# Altium schematic sheet [06] - REVISION HISTORY.SchDoc: REVISION HISTORY
size 433 x 279 mm; Author: ZAG; DrawnBy: ZAG; DocumentNumber: 6; SheetNumber: 6; SheetTotal: 6; PageSetup: Record=PageOptions|CenterHorizontal=True|CenterVertical=True|PrintScale=0.96|XCorrection=1.00|YCorrection=1.00|PrintKind=2|BorderSize=5000000|LeftOffset=0|BottomOffset=0|Orientation=2|PaperLength=4318|PaperWidth=2794|Scale=100|PaperSource=15|PrintQuality=600|MediaType=1|DitherType=10|PaperKind=11x17|PrintScaleMode=1; SchRevision: 01; PCBRevision: 01; Project: VAN BATT CTRLR V1; SchStatus: PRELIM
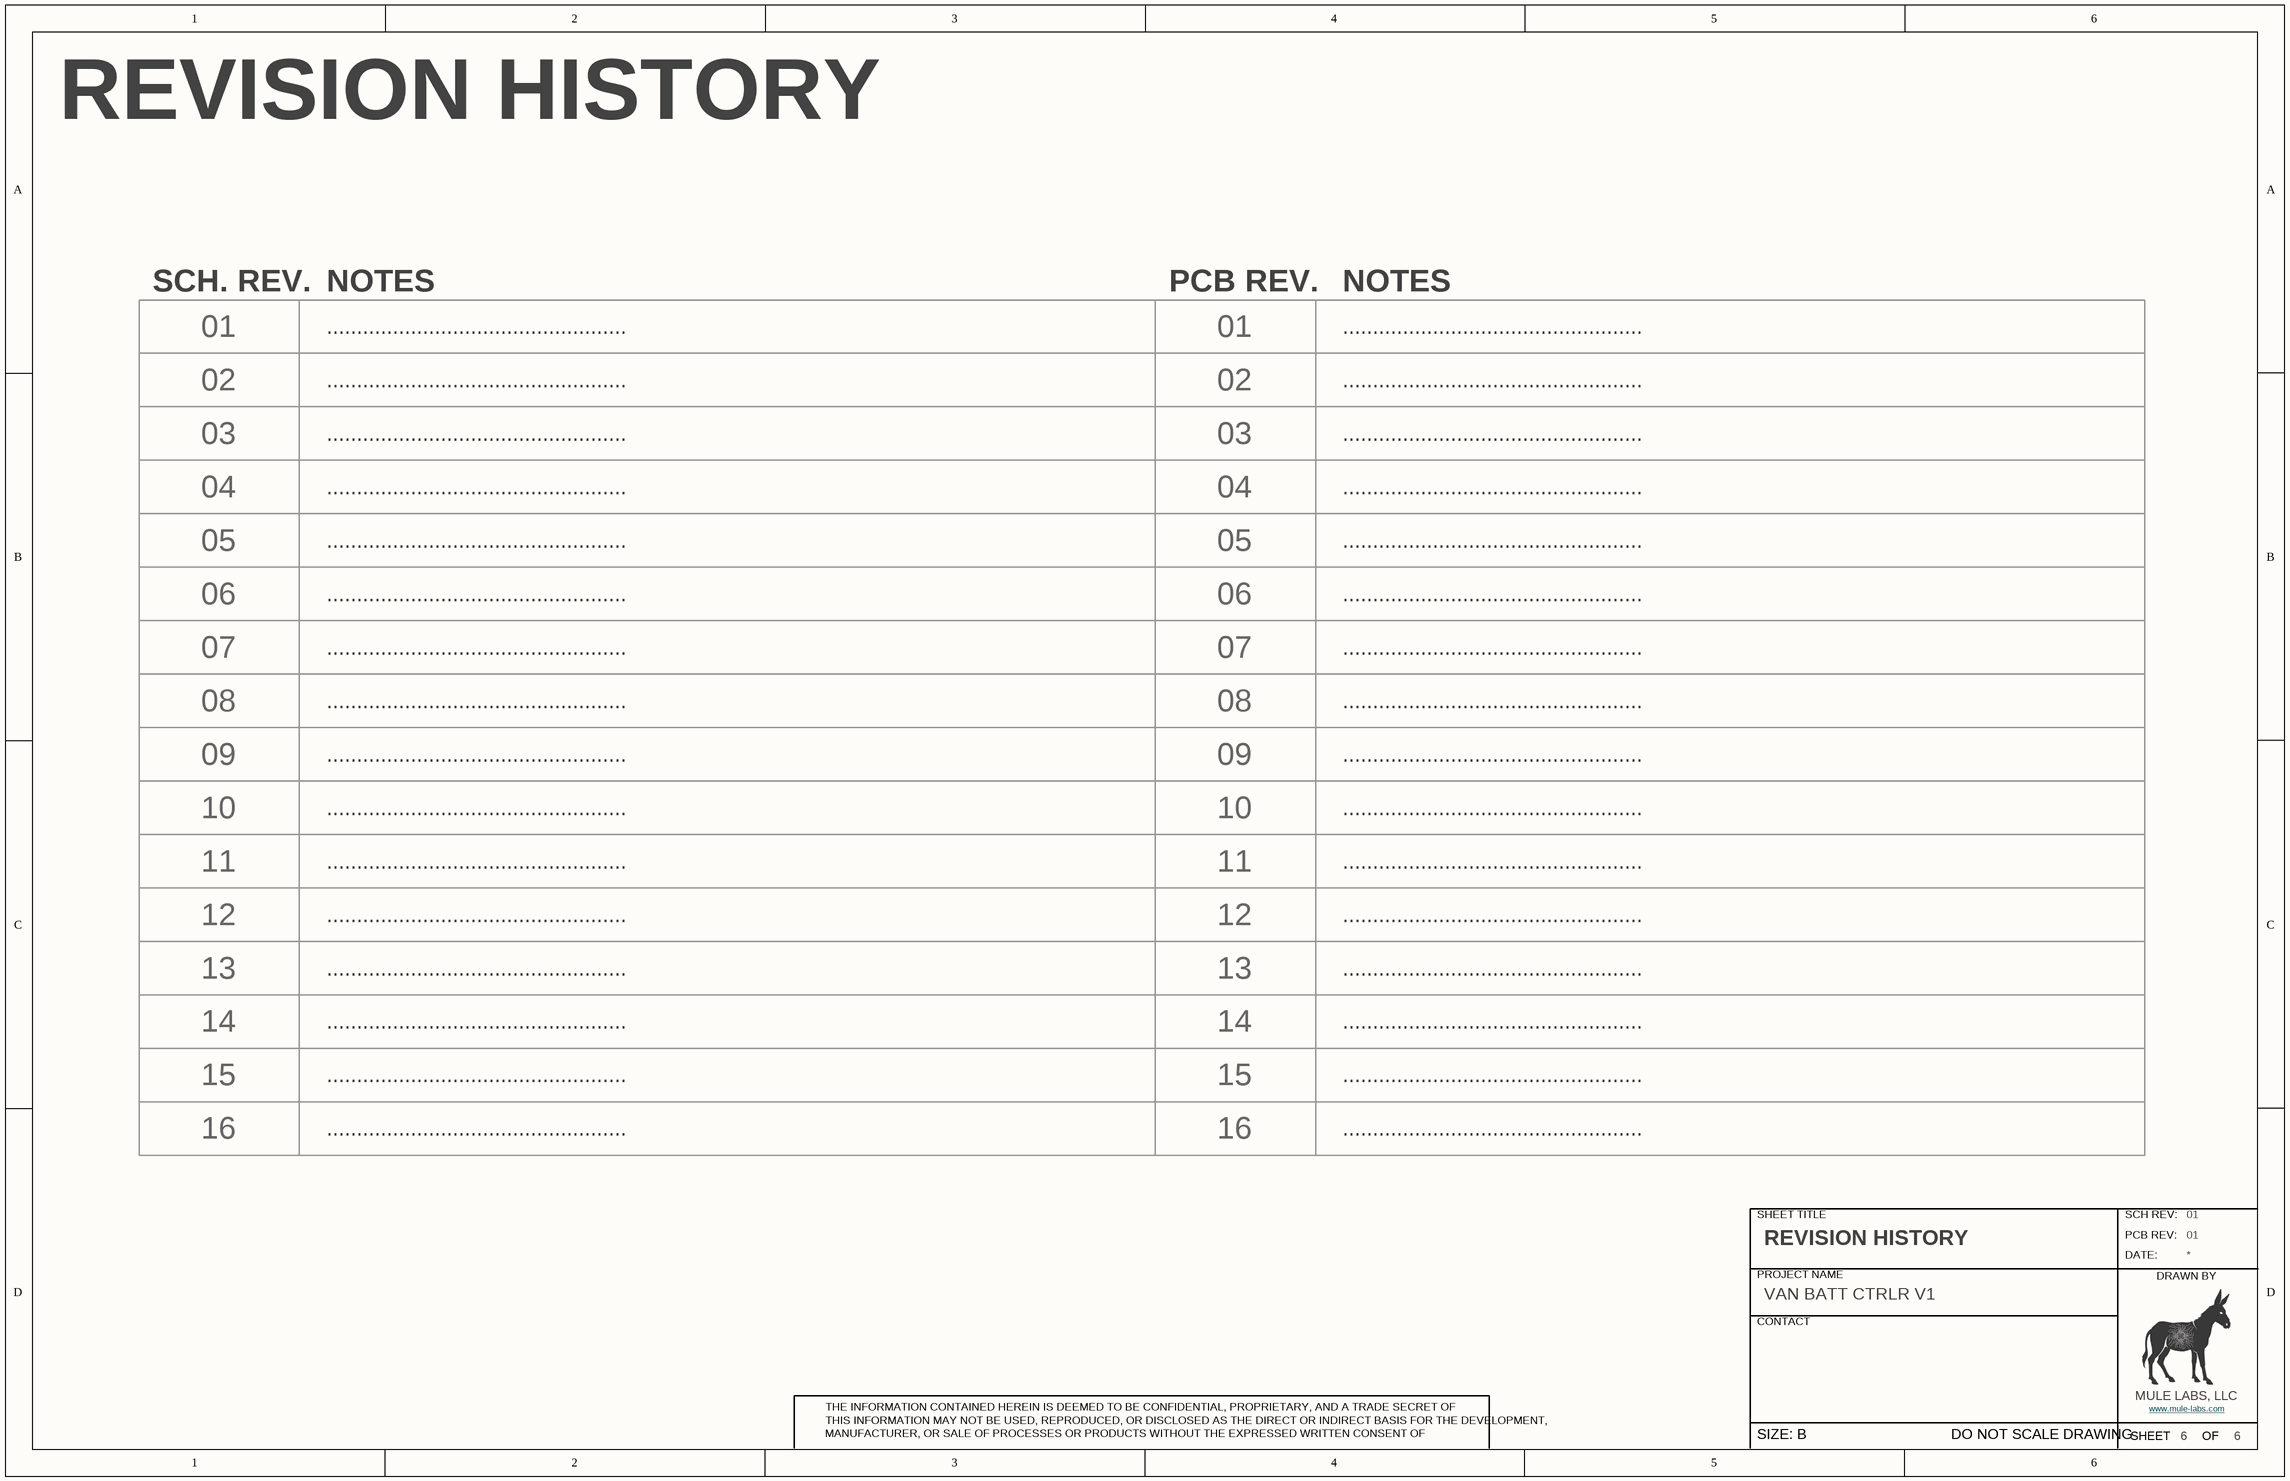
[diagram p0: [06] - REVISION HISTORY.SchDoc]

## Notes on the sheet
- SCH. REV.
- NOTES
- PCB REV.
- 01
- ..................................................
- 02
- 03
- 04
- 05
- 06
- 07
- 08
- 09
- 10
- 11
- 12
- 13
- 14
- 15
- 16
- SHEET TITLE
- SCH REV:
- PROJECT NAME
- PCB REV:
- DATE:
- DRAWN BY
- CONTACT
- MANUFACTURER, OR SALE OF PROCESSES OR PRODUCTS WITHOUT THE EXPRESSED WRITTEN CONSENT OF
- THE INFORMATION CONTAINED HEREIN IS DEEMED TO BE CONFIDENTIAL, PROPRIETARY, AND A TRADE SECRET OF
- THIS INFORMATION MAY NOT BE USED, REPRODUCED, OR DISCLOSED AS THE DIRECT OR INDIRECT BASIS FOR THE DEVELOPMENT,
- SHEET
- MULE LABS, LLC
- www.mule-labs.com <http://www.mule-labs.com>
- OF
- SIZE: B
- DO NOT SCALE DRAWING